# EAGLE design untitled (EAGLE 9.6.2)
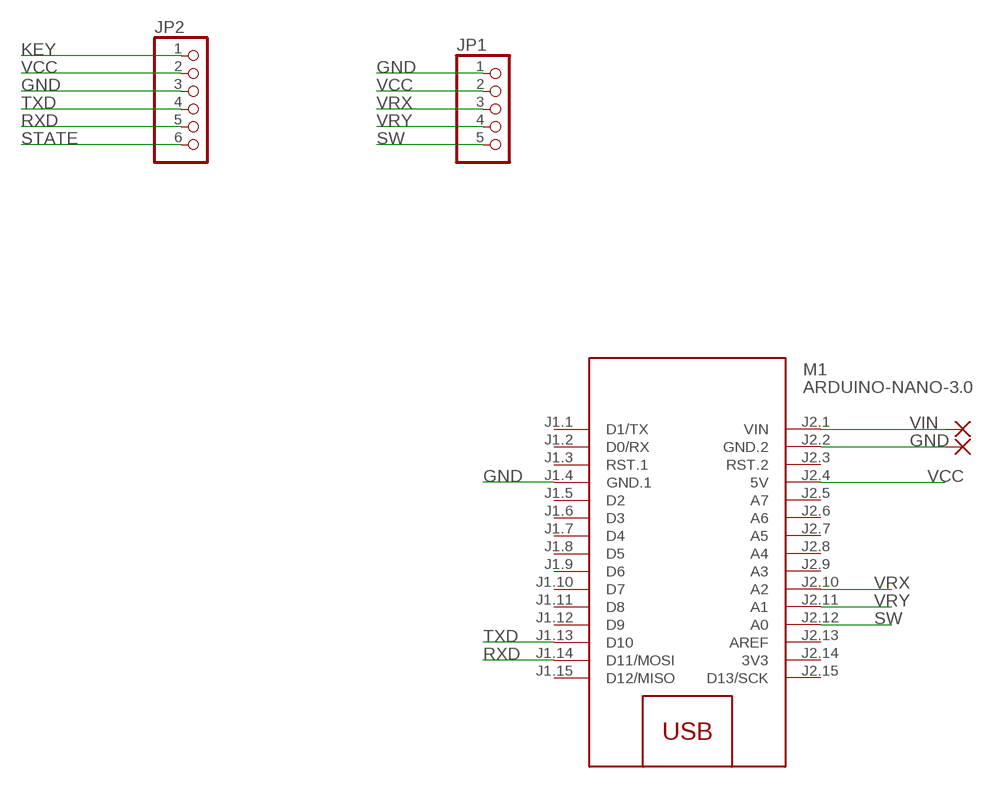
[diagram p0: schematic, sheet 1]

## Parts
JP1  PINHD-1X5  [1X05]
JP2  PINHD-1X6  [1X06]
M1  ARDUINO-NANO-3.0  [ARDUINO-NANO-3.0]
PAD1  WIREPADSMD5-2,5  [5-2,5]
PAD2  WIREPADSMD5-2,5  [5-2,5]

## Nets
GND: JP1.1 JP2.3 M1.J1.4(GND.1) M1.J2.2(GND.2) PAD2.1(P)
KEY: JP2.1
RXD: JP2.5 M1.J1.14(D11/MOSI)
STATE: JP2.6
SW: JP1.5 M1.J2.12(A0)
TXD: JP2.4 M1.J1.13(D10)
VCC: JP1.2 JP2.2 M1.J2.4(5V)
VIN: M1.J2.1(VIN) PAD1.1(P)
VRX: JP1.3 M1.J2.10(A2)
VRY: JP1.4 M1.J2.11(A1)
Unconnected: M1.J1.1(D1/TX) M1.J1.2(D0/RX) M1.J1.3(RST.1) M1.J1.5(D2) M1.J1.6(D3) M1.J1.7(D4) M1.J1.8(D5) M1.J1.9(D6) M1.J1.10(D7) M1.J1.11(D8) M1.J1.12(D9) M1.J1.15(D12/MISO) M1.J2.3(RST.2) M1.J2.5(A7) M1.J2.6(A6) M1.J2.7(A5) M1.J2.8(A4) M1.J2.9(A3) M1.J2.13(AREF) M1.J2.15(D13/SCK)

## Power pins joined to a net without a drawn wire
3V3: M1.J2.14(3V3)

## Library data of the parts
JP1 = pinhead:PINHD-1X5: PIN HEADER
JP2 = pinhead:PINHD-1X6: PIN HEADER
M1 = diy-modules:ARDUINO-NANO-3.0: Arduino Nano 3.0 and compatible devices More details available here: https://www.arduino.cc/en/Main/ArduinoBoardNano Click here to find device on ebay.com <http://www.ebay.com/sch/arduino+nano>
PAD1 PAD2 = wirepad:WIREPAD: Wire PAD connect wire on PCB

## Board
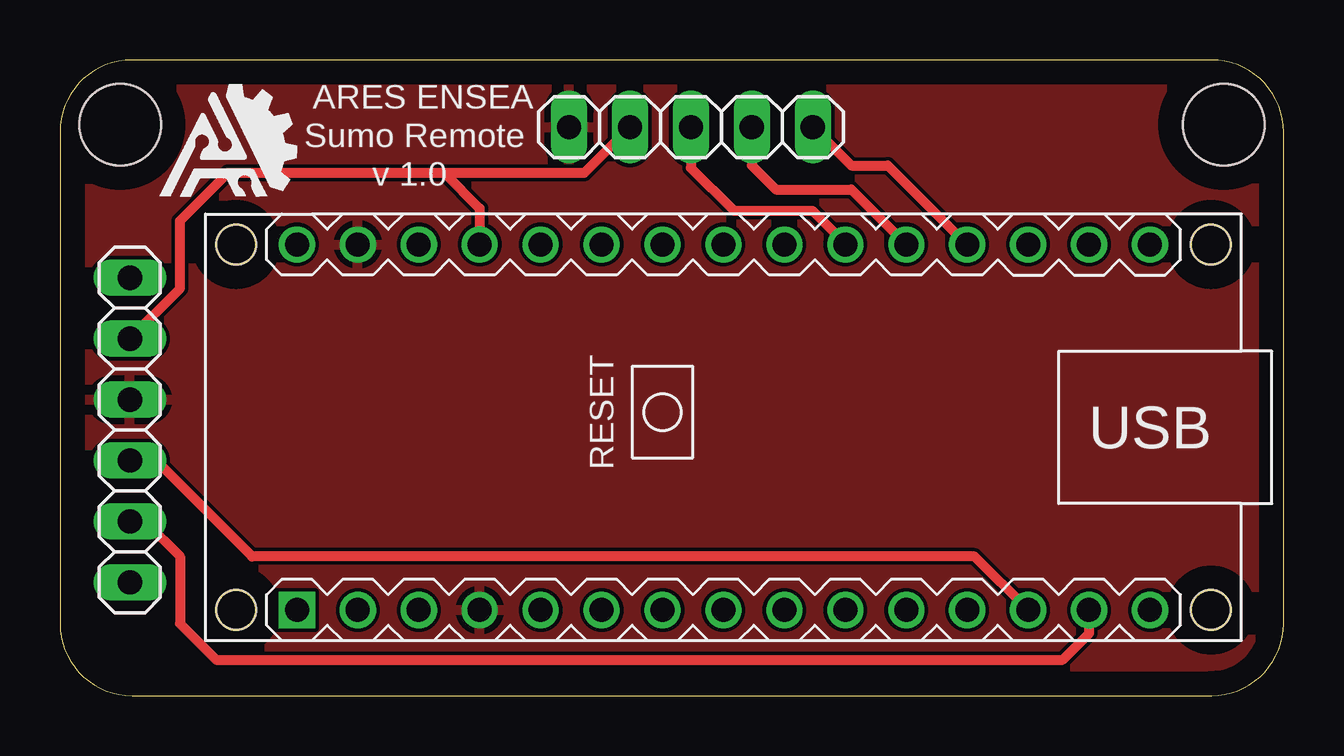
[diagram p1: board, top side]
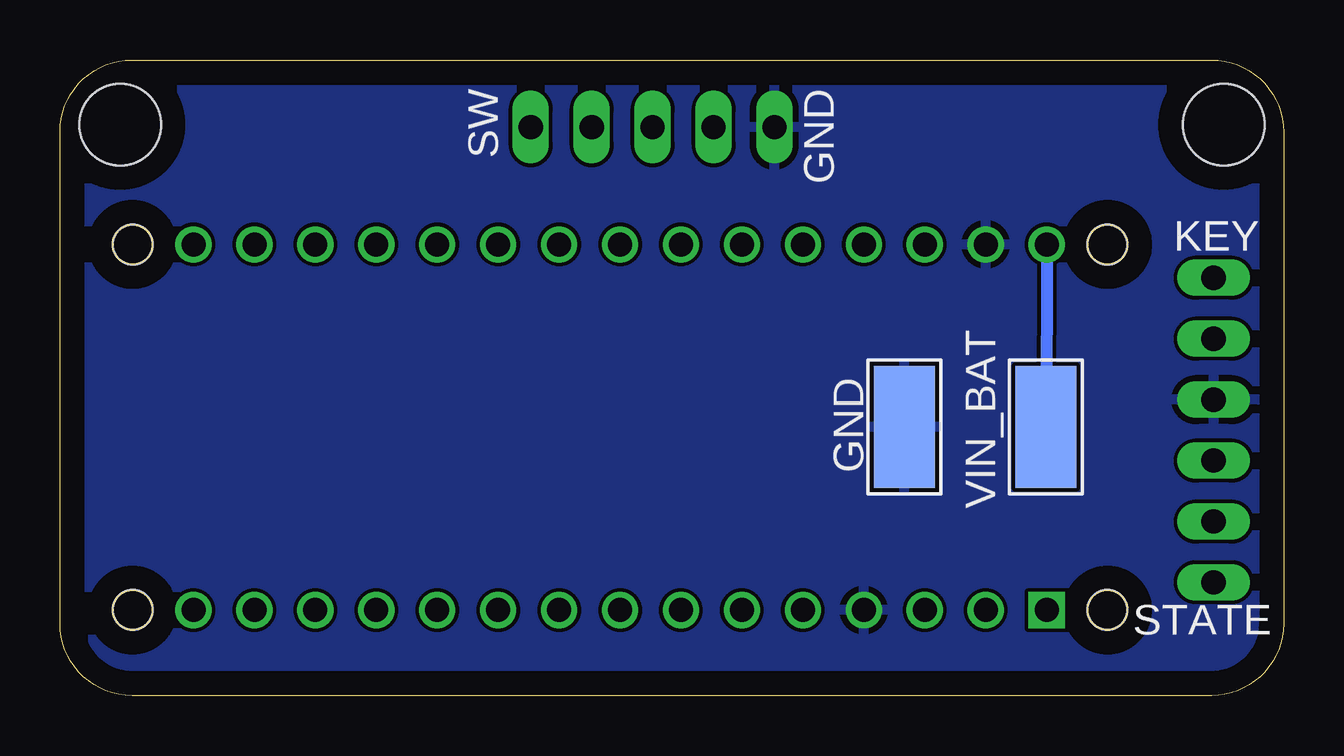
[diagram p2: board, bottom side, seen from below]

Size 51 x 26.5 mm. Coordinates in mm from the lower left corner, seen from the top.
Outline: 8.16,3.61 arc174 6.51,3.61 6.51,3.52 arc174 8.16,3.52 8.16,3.61
Outline: 8.16,18.84 arc174 6.51,18.84 6.51,18.76 arc174 8.16,18.76 8.16,18.84
Outline: 48.8,3.61 arc174 47.15,3.61 47.15,3.52 arc174 48.8,3.52 48.8,3.61
Outline: 48.8,18.84 arc174 47.15,18.84 47.15,18.76 arc174 48.8,18.76 48.8,18.84
Outline: 51,23.5 arc90 48,26.5 3,26.5 arc90 0,23.5 0,3 arc90 3,0 48,0 arc90 51,3 51,23.5
Copper layers (1*16): Top 0.035mm / dielectric 1.5mm / Bottom 0.035mm
Design rules "default": minimum track width 6mil, minimum drill 0.35mm, track to track 6mil, track to pad 6mil, pad to pad 6mil, via to via 6mil, smd to smd 6mil, copper to edge 40mil, drill to drill 6mil, minimum pad ring 10mil, minimum via ring 8mil, stop-mask expansion 4mil, vias tented up to drill 0mil, thermal gap 10mil
Holes 1.65 mm at 47.97,18.8 7.34,18.8 7.34,3.56 47.97,3.56
Holes 3.4 mm at 48.5,23.8 2.5,23.8

### Footprints (pad centres in the part's own frame; a part is rotated, then mirrored left to right if it is on the bottom)
1X05 = drill 1.016 long: 1 -5.08,0; 2 -2.54,0; 3 0,0; 4 2.54,0; 5 5.08,0
1X06 = drill 1.016 long: 1 -6.35,0; 2 -3.81,0; 3 -1.27,0; 4 1.27,0; 5 3.81,0; 6 6.35,0
ARDUINO-NANO-3.0 = drill 1 square: J1.1 17.78,7.62 | drill 1: J1.2 15.24,7.62; J1.3 12.7,7.62; J1.4 10.16,7.62; J1.5 7.62,7.62; J1.6 5.08,7.62; J1.7 2.54,7.62; J1.8 0,7.62; J1.9 -2.54,7.62; J1.10 -5.08,7.62; J1.11 -7.62,7.62; J1.12 -10.16,7.62; J1.13 -12.7,7.62; J1.14 -15.24,7.62; J1.15 -17.78,7.62; J2.1 17.78,-7.62; J2.2 15.24,-7.62; J2.3 12.7,-7.62; J2.4 10.16,-7.62; J2.5 7.62,-7.62; J2.6 5.08,-7.62; J2.7 2.54,-7.62; J2.8 0,-7.62; J2.9 -2.54,-7.62; J2.10 -5.08,-7.62; J2.11 -7.62,-7.62; J2.12 -10.16,-7.62; J2.13 -12.7,-7.62; J2.14 -15.24,-7.62; J2.15 -17.78,-7.62 | hole 1.651: -20.32,7.62; -20.32,-7.62; 20.32,-7.62; 20.32,7.62
5-2,5 = smd 2.54 x 5.08: 1 0,0

### Placement (x,y rotation side)
JP1  26.3,23.7 0 top
JP2  2.91,11.07 270 top
M1  27.66,11.18 180 top
PAD1  9.9,11.2 0 bottom
PAD2  15.8,11.2 0 bottom

### Tracks (layer width: path | path; a pad name or v marks a point on that pad's centre or on a via)
GND
  pour Top: -1,22.8 -1,27.3 52.5,27.3 52.5,-1.2 -1,-1.2
  pour Bottom: -2,27.8 -2,-2.2 53.5,-2.2 53.5,28.3 -2,28.3
RXD
  Top 0.406: JP2.5 3.54,7.26 5,5.8 5,3 6.5,1.5 41.8,1.5 42.9,2.6 M1.J1.14
SW
  Top 0.406: JP1.5 32.98,22.1 34.5,22.1 37.8,18.8 M1.J2.12
TXD
  Top 0.406: M1.J1.13 38.12,5.8 8,5.8 4,9.8 JP2.4
VCC
  Top 0.406: JP2.2 5,16.97 5,19.8 7,21.8 16,21.8 | 16,21.8 17.5,20.3 M1.J2.4 | 16,21.8 21.86,21.8 JP1.2
VIN
  Bottom 0.406: 9.88,11.23 PAD1.1
  Bottom 0.508: M1.J2.1 9.88,11.23
VRX
  Top 0.406: JP1.3 26.3,22 28.09,20.21 31.35,20.21 32.74,18.83 M1.J2.10
VRY
  Top 0.406: JP1.4 28.84,22.1 29.84,21.1 32.98,21.1 M1.J2.11

### Text on the board
tPlace: ARES ENSEA | Sumo Remote | v 1.0
bPlace: GND | SW | KEY | GND | VIN_BAT | STATE